# EAGLE design blink_tutorial (EAGLE 9.6.2)
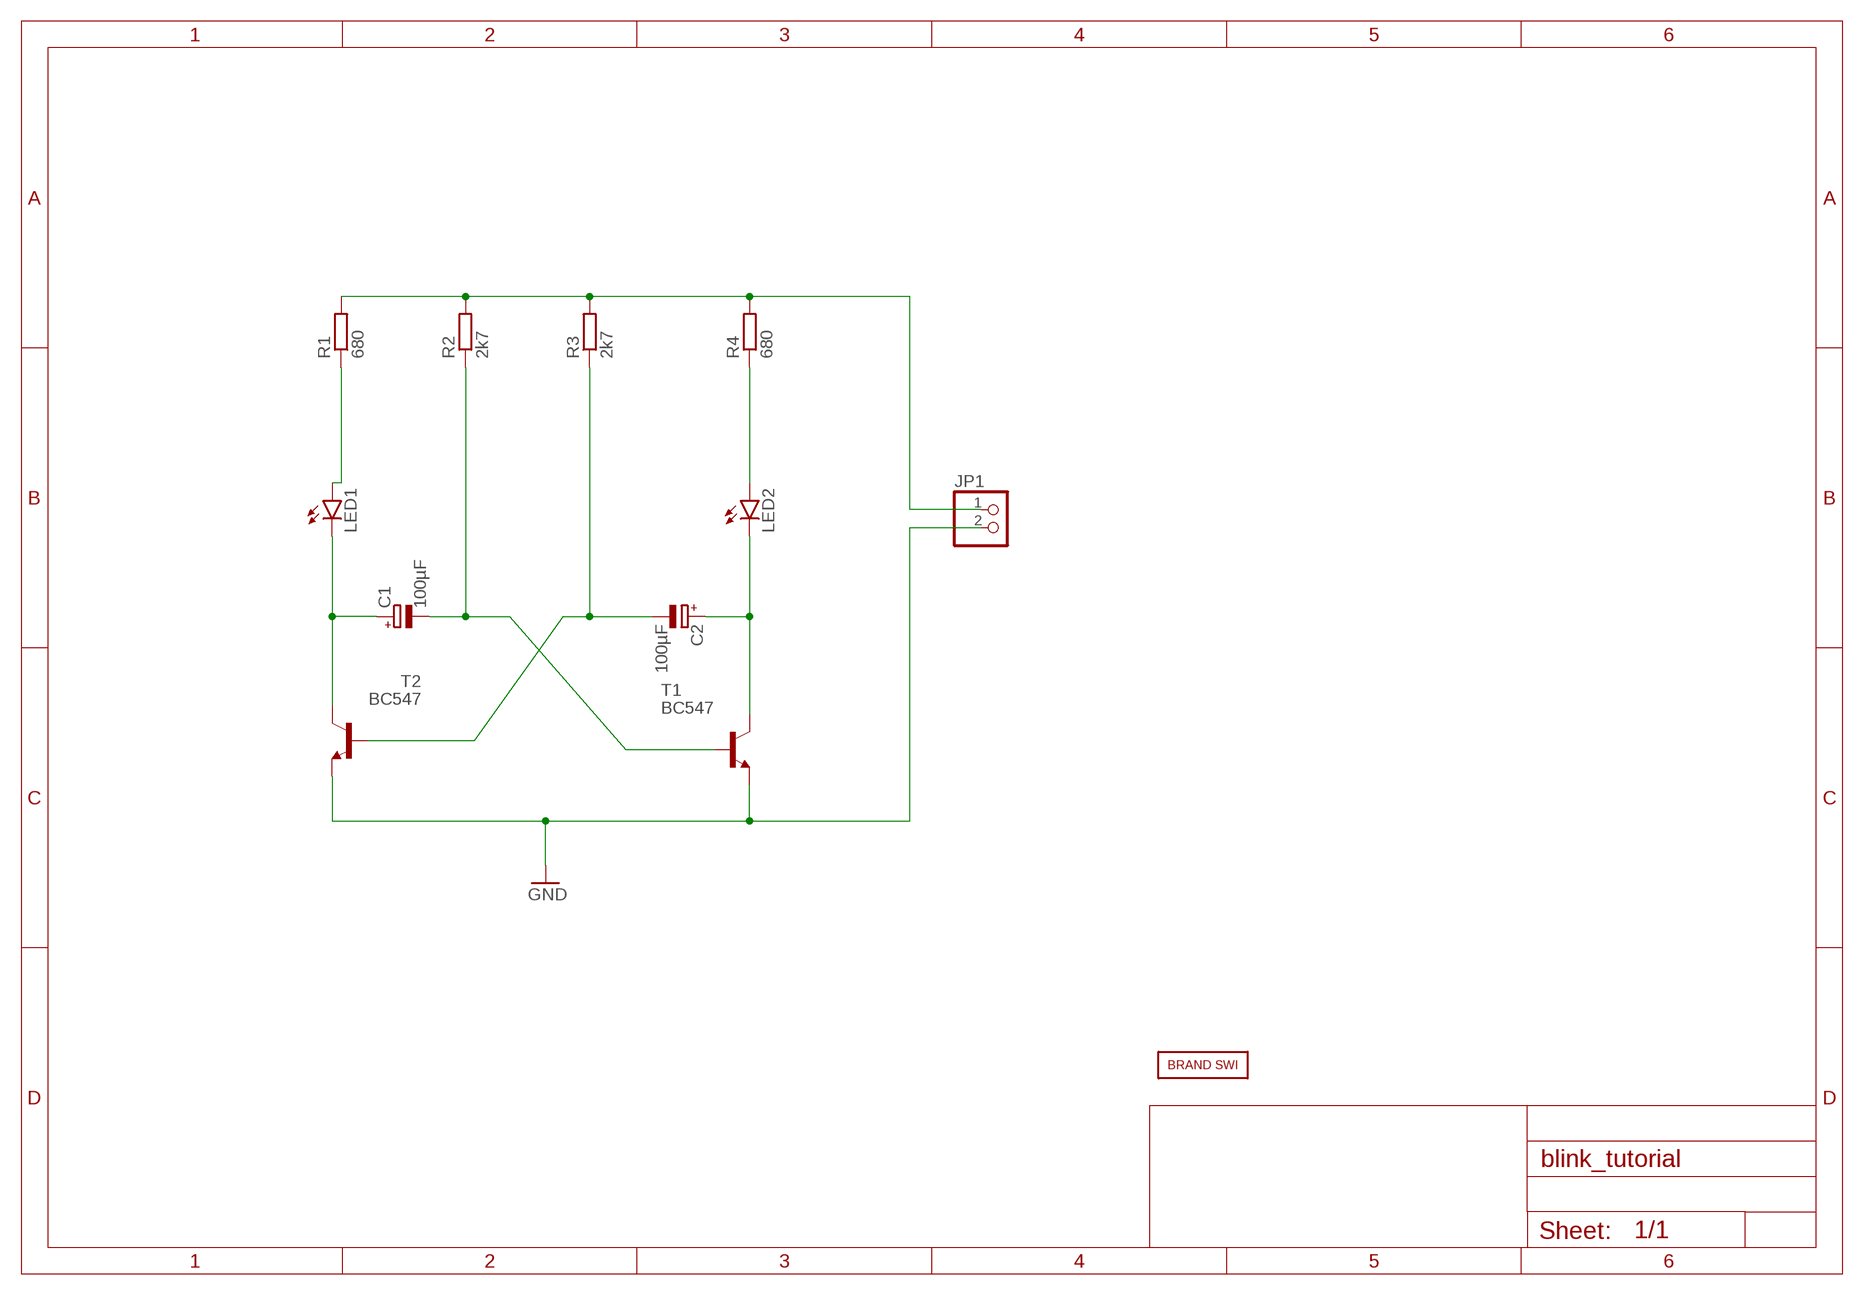
[diagram p0: schematic, sheet 1]

## Parts
C1  100µF  CPOL-EUE2.5-6  [E2,5-6]
C2  100µF  CPOL-EUE2.5-6  [E2,5-6]
JP1  PINHD-1X2  [1X02]
LED1  LED5MM  [LED5MM]
LED2  LED5MM  [LED5MM]
R1  680  R-EU_M1206  [M1206]
R2  2k7  R-EU_M1206  [M1206]
R3  2k7  R-EU_M1206  [M1206]
R4  680  R-EU_M1206  [M1206]
T1  BC547  [TO92]
T2  BC547  [TO92]
U$1  SIG1  BRAND_SWI5X7  [BRAND_SWI_5X7]

## Nets
GND: JP1.2 T1.1(E) T2.1(E)
N$1: JP1.1 R1.2 R2.2 R3.2 R4.2
N$2: LED1.A R1.1
N$3: LED2.A R4.1
N$4: C1.+ LED1.K(C) T2.3(C)
N$5: C2.+ LED2.K(C) T1.3(C)
N$6: C2.- R3.1 T2.2(B)
N$7: C1.- R2.1 T1.2(B)

## Library data of the parts
C1 C2 = rcl:CPOL-EU: POLARIZED CAPACITOR, European symbol; SPICEPREFIX: C
JP1 = pinhead:PINHD-1X2: PIN HEADER
LED1 LED2 = led:LED: LED OSRAM: - CHIPLED LG R971, LG N971, LY N971, LG Q971, LY Q971, LO R971, LY R971 LH N974, LH R974 LS Q976, LO Q976, LY Q976 LO Q996 - Hyper CHIPLED LW Q18S LB Q993, LB Q99A, LB R99A - SideLED LS A670, LO A670, LY A670, LG A670, LP A670 LB A673, LV A673, LT A673, LW A673 LH A674 LY A675 LS A676, LA A676, LO A676, LY A676, LW A676 LS A679, LY A679, LG A679 - Hyper Micro SIDELED® LS Y876, LA Y876, LO Y876, LY Y876 LT Y87S - SmartLED LW L88C, LW L88S LB L89C, LB L89S, LG L890 LS L89K, LO L89K, LY L89K LS L896, LA L896, LO L896, LY L896 - TOPLED LS T670, LO T670, LY T670, LG T670, LP T670 LSG T670, LSP T670, LSY T670, LOP T670, LYG T670 LG T671, LOG T671, LSG T671 LB T673, LV T673, LT T673, LW T673 LH T674 LS T676, LA T676, LO T676, LY T676, LB T676, LH T676, LSB T676, LW T676 LB T67C, LV T67C, LT T67C, LS T67K, LO T67K, LY T67K, LW E67C LS E67B, LA E67B, LO E67B, LY E67B, LB E67C, LV E67C, LT E67C LW T67C LS T679, LY T679, LG T679 LS T770, LO T770, LY T770, LG T770, LP T770 LB T773, LV T773, LT T773, LW T773 LH T774 LS E675, LA E675, LY E675, LS T675 LS T776, LA T776, LO T776, LY T776, LB T776 LHGB T686 LT T68C, LB T68C - Hyper Mini TOPLED® LB M676 - Mini TOPLED Santana® LG M470 LS M47K, LO M47K, LY M47K Source: http://www.osram.convergy.de LUXEON: - LUMILED® LXK2-PW12-R00, LXK2-PW12-S00, LXK2-PW14-U00, LXK2-PW14-V00 LXK2-PM12-R00, LXK2-PM12-S00, LXK2-PM14-U00 LXK2-PE12-Q00, LXK2-PE12-R00, LXK2-PE12-S00, LXK2-PE14-T00, LXK2-PE14-U00 LXK2-PB12-K00, LXK2-PB12-L00, LXK2-PB12-M00, LXK2-PB14-N00, LXK2-PB14-P00, LXK2-PB14-Q00 LXK2-PR12-L00, LXK2-PR12-M00, LXK2-PR14-Q00, LXK2-PR14-R00 LXK2-PD12-Q00, LXK2-PD12-R00, LXK2-PD12-S00 LXK2-PH12-R00, LXK2-PH12-S00 LXK2-PL12-P00, LXK2-PL12-Q00, LXK2-PL12-R00 Source: www.luxeon.com KINGBRIGHT: KA-3528ASYC Source: www.kingbright.com
R1-R4 = SWI_COMMONS:R-EU_: RESISTOR, European symbol
T1 T2 = transistor:BC547: NPN TRANSISTOR
U$1 = SWI_COMMONS:BRAND_SWI

## Board
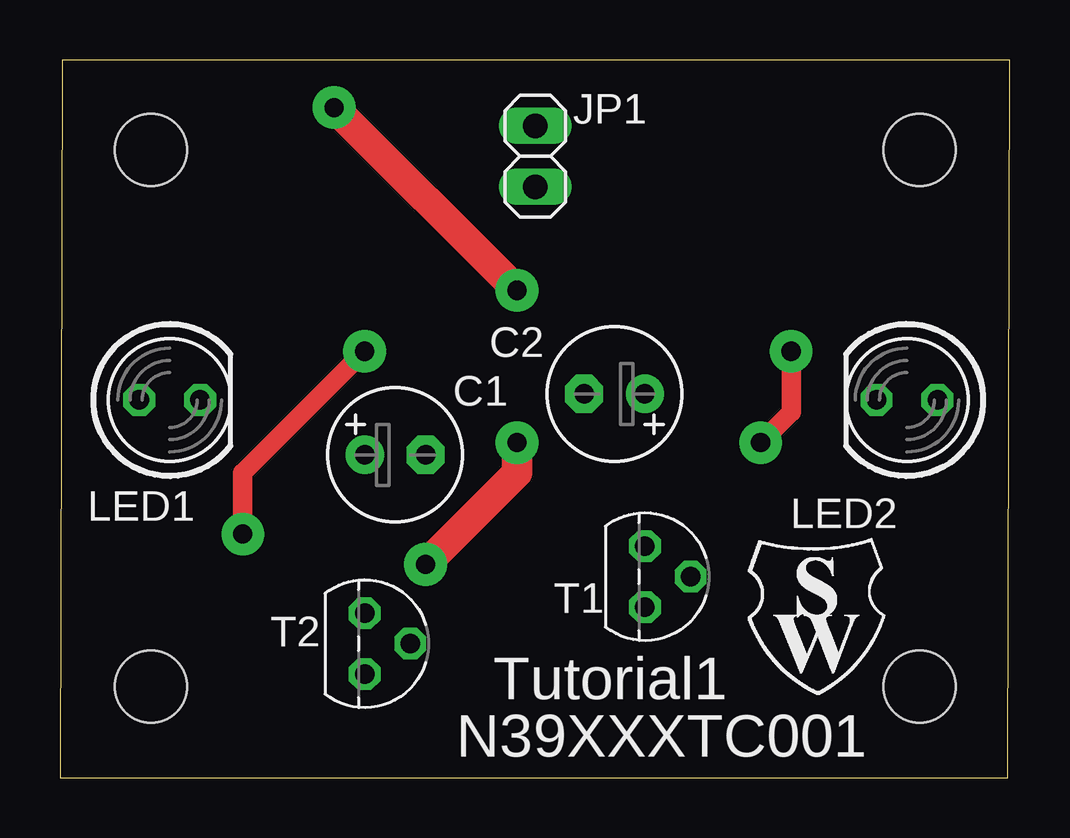
[diagram p1: board, top side]
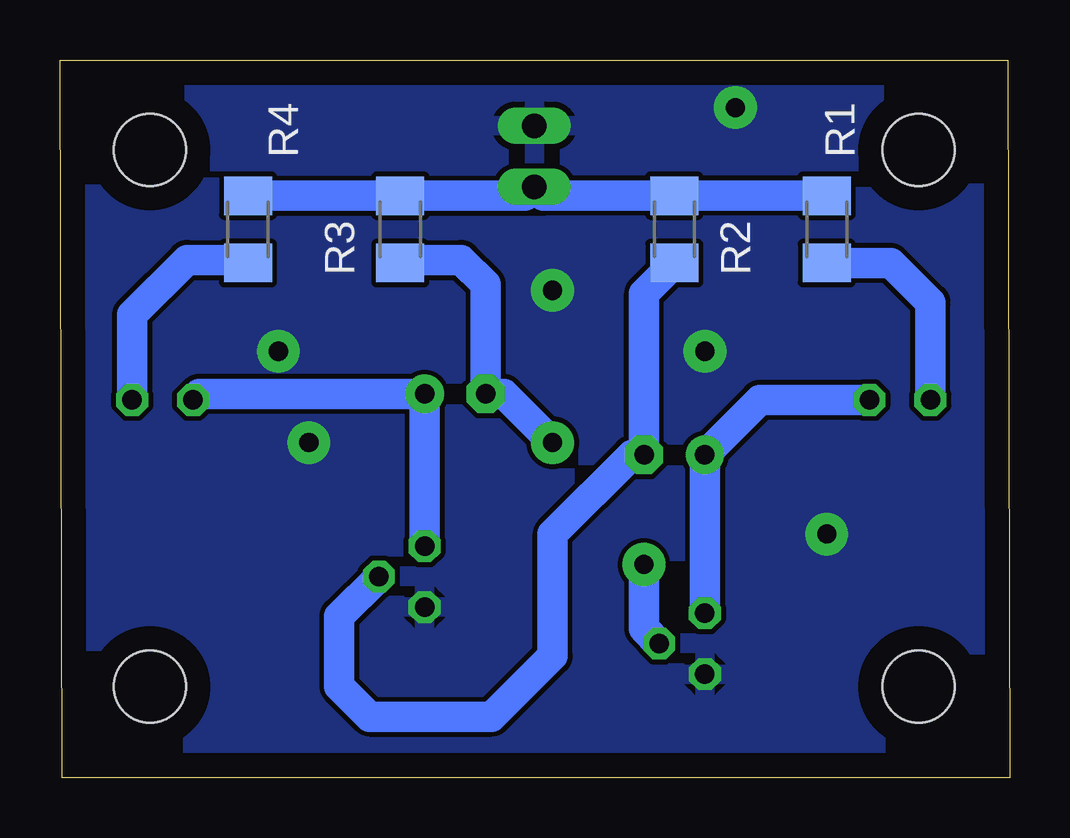
[diagram p2: board, bottom side, seen from below]

Size 39.58 x 29.92 mm. Coordinates in mm from the lower left corner, seen from the top.
Outline: 0,0 39.5,0 39.58,29.92 0.08,29.92 0,0
Copper layers (1*16): Top 0.035mm / dielectric 1.5mm / Bottom 0.035mm
Design rules "default *": minimum track width 6mil, minimum drill 0.35mm, track to track 8mil, track to pad 6mil, pad to pad 6mil, via to via 6mil, smd to smd 6mil, copper to edge 40mil, drill to drill 6mil, minimum pad ring 10mil, minimum via ring 8mil, stop-mask expansion 4mil, vias tented up to drill 0mil, thermal gap 10mil
Holes 3 mm at 3.79,26.18 35.83,26.18 35.83,3.79 3.79,3.79

### Footprints (pad centres in the part's own frame; a part is rotated, then mirrored left to right if it is on the bottom)
E2,5-6 = drill 0.813 pad 1.6: + -1.27,0 | drill 0.813 pad 1.6 octagon: - 1.27,0
1X02 = drill 1.016 long: 1 -1.27,0; 2 1.27,0
LED5MM = drill 0.813 octagon: A -1.27,0; K 1.27,0
M1206 = smd 1.6 x 2: 1 -1.4,0; 2 1.4,0
TO92 = drill 0.813 octagon: 1 1.27,0; 2 0,1.905; 3 -1.27,0

### Placement (x,y rotation side)
C1  13.97,13.46 0 top
C2  23.11,16 180 top
JP1  19.81,25.91 90 top
LED1  4.57,15.75 0 top
LED2  35.31,15.75 180 top
R1  7.62,22.86 90 bottom
R2  13.97,22.86 90 bottom
R3  25.4,22.86 90 bottom
R4  31.75,22.86 90 bottom
T1  24.38,8.38 270 top
T2  12.7,5.59 270 top
U$1  28.46,3.3 0 top

### Tracks (layer width: path | path; a pad name or v marks a point on that pad's centre or on a via)
GND  (via drill 0.8 pad 1.78)
  Top 0.813: v30.48,17.78 30.48,15.24 v29.21,13.97 | v12.7,17.78 7.62,12.7 v7.62,10.16
  Top 1.27: v19.05,20.32 v11.43,27.94
  pour Bottom: 0,29.97 39.37,29.97 39.37,0.25 0.25,0.25 0.25,29.72
N$1
  Bottom 1.27: R4.2 R3.2 20.19,24.26 JP1.1 19.43,24.26 R2.2 R1.2
N$2
  Bottom 1.27: LED1.A 3.3,19.81 4.95,21.46 R1.1
N$3
  Bottom 1.27: 36.58,18.35 LED2.A 36.58,19.3 34.29,21.59 31.88,21.59 R4.1
N$4
  Bottom 1.27: LED1.K 10.41,15.75 C1.+ T2.3
N$5
  Bottom 0.813: 33.78,16 LED2.K
  Bottom 1.27: 33.78,16 C2.+ T1.3
N$6  (via drill 0.8 pad 1.78)
  Top 1.27: v15.24,8.89 19.05,12.7 v19.05,13.97
  Bottom 1.27: T2.2 15.24,6.22 v15.24,8.89 | v19.05,13.97 21.08,16 C2.- 21.84,20.57 22.86,21.59 25.27,21.59 R3.1
N$7
  Bottom 1.27: T1.2 27.94,6.73 27.94,3.81 26.67,2.54 21.59,2.54 19.05,5.08 19.05,10.16 15.75,13.46 C1.- 15.24,20.19 R2.1

### Text on the board
_tNames: Tutorial1 | N39XXXTC001